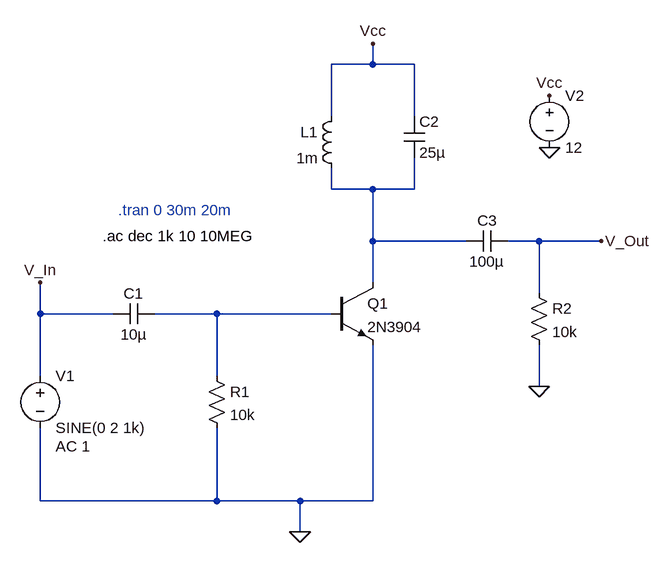
[diagram p0: schematic Class_C_Amplifier.asc]
Class_C_Amplifier.asc, the LTspice schematic file:
Version 4.1
SHEET 1 880 680
WIRE 304 -176 304 -208
WIRE 304 -176 240 -176
WIRE 368 -176 304 -176
WIRE 240 -96 240 -176
WIRE 368 -96 368 -176
WIRE 240 16 240 -16
WIRE 304 16 240 16
WIRE 368 16 368 -32
WIRE 368 16 304 16
WIRE 304 96 304 16
WIRE 448 96 304 96
WIRE 560 96 512 96
WIRE 656 96 560 96
WIRE 304 160 304 96
WIRE 560 176 560 96
WIRE -208 208 -208 160
WIRE -96 208 -208 208
WIRE 64 208 -32 208
WIRE 240 208 64 208
WIRE -208 304 -208 208
WIRE 64 304 64 208
WIRE 560 320 560 256
WIRE -208 496 -208 384
WIRE 64 496 64 384
WIRE 64 496 -208 496
WIRE 192 496 64 496
WIRE 304 496 304 256
WIRE 304 496 192 496
WIRE 192 544 192 496
FLAG 560 320 0
FLAG 576 -128 Vcc
FLAG 304 -208 Vcc
FLAG 576 -48 0
FLAG 192 544 0
FLAG 656 96 V_Out
FLAG -208 160 V_In
SYMBOL voltage -208 288 R0
WINDOW 123 24 124 Left 2
WINDOW 39 0 0 Left 0
SYMATTR Value2 AC 1
SYMATTR InstName V1
SYMATTR Value SINE(0 2 1k)
SYMBOL voltage 576 -144 R0
WINDOW 123 0 0 Left 0
WINDOW 39 0 0 Left 0
SYMATTR InstName V2
SYMATTR Value 12
SYMBOL cap -32 192 R90
WINDOW 0 0 32 VBottom 2
WINDOW 3 32 32 VTop 2
SYMATTR InstName C1
SYMATTR Value 10µ
SYMBOL res 48 288 R0
SYMATTR InstName R1
SYMATTR Value 10k
SYMBOL npn 240 160 R0
SYMATTR InstName Q1
SYMATTR Value 2N3904
SYMBOL ind 256 -112 M0
SYMATTR InstName L1
SYMATTR Value 1m
SYMATTR SpiceLine Rser=1m
SYMBOL cap 352 -96 R0
SYMATTR InstName C2
SYMATTR Value 25µ
SYMBOL cap 512 80 R90
WINDOW 0 0 32 VBottom 2
WINDOW 3 32 32 VTop 2
SYMATTR InstName C3
SYMATTR Value 100µ
SYMBOL res 544 160 R0
SYMATTR InstName R2
SYMATTR Value 10k
TEXT -112 88 Left 2 !.ac dec 1k 10 10MEG
TEXT -88 48 Left 2 ;.tran 0 30m 20m

The netlist it stands for:
* Class_C_Amplifier.asc
V1 V_In 0 SINE(0 2 1k) AC 1
V2 Vcc 0 12
C1 N002 V_In 10µ
R1 N002 0 10k
Q1 N001 N002 0 0 2N3904
L1 Vcc N001 1m Rser=1m
C2 Vcc N001 25µ
C3 V_Out N001 100µ
R2 V_Out 0 10k
.model NPN NPN
.model PNP PNP
.lib standard.bjt
.ac dec 1k 10 10MEG
* .tran 0 30m 20m
.backanno
.end